# Altium schematic sheet rest.SchDoc
size A4; SheetNumber: 5; SheetTotal: 5
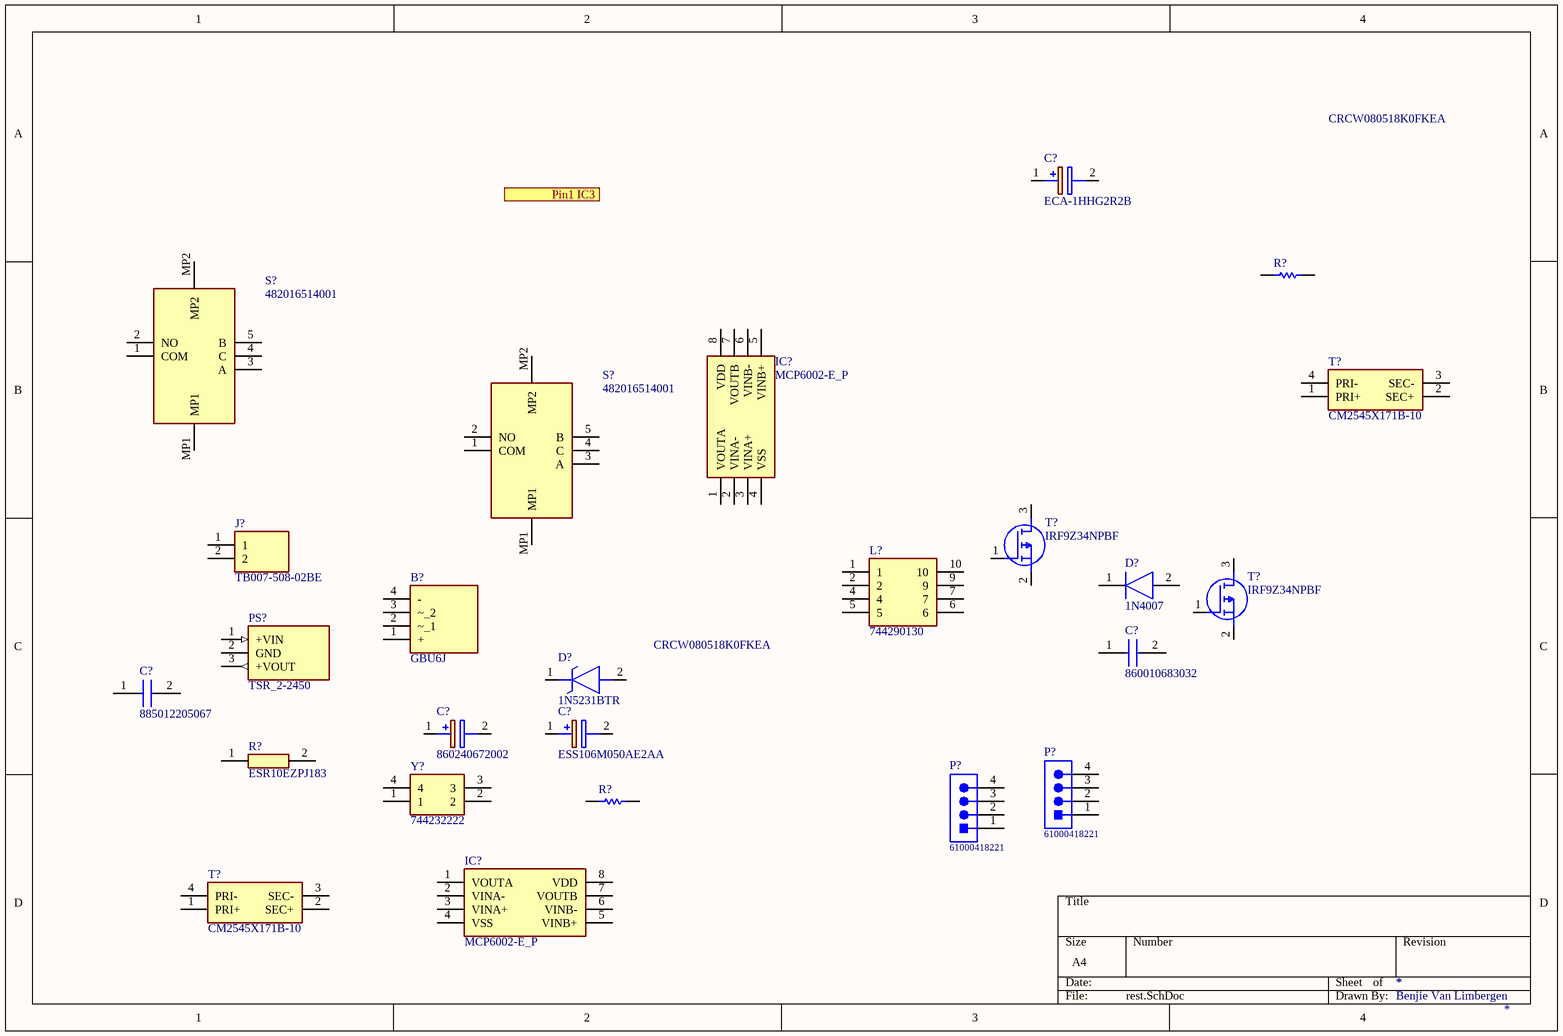
[diagram p0: rest.SchDoc]

## Parts
(Parts that share a designator on the sheet are numbered #1, #2 ... from top to bottom, then left to right.)
B?  GBU6J  [GBU6J]
C?#1  ECA-1HHG2R2B  [CAPPRD200W55D500H1200]
C?#2  860010683032  [CAPPRD1000W80D2200H4100]
C?#3  885012205067  [CAPC1005X55N]
C?#4  860240672002  [CAPPRD200W52D500H1250]
C?#5  ESS106M050AE2AA  [CAPPRD250W45D630H850]
D?#1  1N4007  [DIOAD1410W86L470D235]
D?#2  1N5231BTR  [DIOAD1068W53L380D172]
IC?#1  MCP6002-E_P  [DIP781W56P254L950H533Q8N]
IC?#2  MCP6002-E_P  [DIP781W56P254L950H533Q8N]
J?  TB007-508-02BE  [TB00750802BE]
L?  744290130  [744290130]
P?#1  61000418221  [61000418221]
P?#2  61000418221  [61000418221]
PS?  TSR_2-2450  [TSR-2]
R?#1  CRCW080518K0FKEA  [RESC2013X50X30NL20T20]
R?#2  ESR10EZPJ183  [RESC2012X65N]
R?#3  CRCW080518K0FKEA  [RESC2013X50X30NL20T20]
S?#1  482016514001  [482016514001]
S?#2  482016514001  [482016514001]
T?#1  CM2545X171B-10  [CM2545X171B10]
T?#2  IRF9Z34NPBF  [TO254P469X1042X1967-3P]
T?#3  IRF9Z34NPBF  [TO254P469X1042X1967-3P]
T?#4  CM2545X171B-10  [CM2545X171B10]
Y?  744232222  [744232222]

## Ports
Pin1 IC3

## Nets

Not connected (* = marked no-connect by the designer): B? 1(+) 2(~_1) 3(~_2) 4(-); C?#1 1(+) 2(-); C?#2 1(+) 2(-); C?#3 1 2; C?#4 1(+) 2(-); C?#5 1(+) 2(-); D?#1 1(K) 2(A); D?#2 1(K) 2(A); IC?#1 1(VOUTA) 2(VINA-) 3(VINA+) 4(VSS) 5(VINB+) 6(VINB-) 7(VOUTB) 8(VDD); IC?#2 1(VOUTA) 2(VINA-) 3(VINA+) 4(VSS) 5(VINB+) 6(VINB-) 7(VOUTB) 8(VDD); J? 1 2; L? 1 2 4 5 6 7 9 10; P?#1 1 2 3 4; P?#2 1 2 3 4; PS? 1(+VIN) 2(GND) 3(+VOUT); R?#1 1 2; R?#2 1 2; R?#3 1 2; S?#1 1(COM) 2(NO) 3(A) 4(C) 5(B) MP1 MP2; S?#2 1(COM) 2(NO) 3(A) 4(C) 5(B) MP1 MP2; T?#1 1(PRI+) 2(SEC+) 3(SEC-) 4(PRI-); T?#2 1(G) 2(S) 3(D); T?#3 1(G) 2(S) 3(D); T?#4 1(PRI+) 2(SEC+) 3(SEC-) 4(PRI-); Y? 1 2 3 4

## Notes on the sheet
- Benjie Van Limbergen

## Library data of the parts
B? = GBU6J: Bridge Rectifier; Manufacturer_Name: GeneSiC Semiconductor; Datasheet Link: https://www.diodemodule.com/silicon_products/bridge_rectifiers/gbu6j.pdf; Height: 18.8mm; Manufacturer_Part_Number: GBU6J
C?#1 = ECA-1HHG2R2B: Capacitor Polarised C4; Manufacturer_Name: Panasonic; Datasheet Link: http://industrial.panasonic.com/cdbs/www-data/pdf/RDF0000/ABA0000C1215.pdf; Height: 12mm; Manufacturer_Part_Number: ECA-1HHG2R2B
C?#2 = 860010683032: Capacitor C1; Manufacturer_Name: Wurth Elektronik; Datasheet Link: https://componentsearchengine.com/Datasheets/2/860010683032.pdf; Height: 41mm; Manufacturer_Part_Number: 860010683032
C?#3 = 885012205067: Capacitor C6, C7, C12,C13; Manufacturer_Name: Wurth Elektronik; Datasheet Link: https://katalog.we-online.com/pbs/datasheet/885012205067.pdf; Height: 0.55mm; Manufacturer_Part_Number: 885012205067
C?#4 = 860240672002: Capacitor Polarised; Manufacturer_Name: Wurth Elektronik; Datasheet Link: https://katalog.we-online.de/pbs/datasheet/860240672002.pdf; Height: 12.5mm; Manufacturer_Part_Number: 860240672002
C?#5 = ESS106M050AE2AA: Capacitor Polarised; Manufacturer_Name: Kemet; Datasheet Link: https://content.kemet.com/datasheets/KEM_A4057_ESS.pdf; Height: 8.5mm; Manufacturer_Part_Number: ESS106M050AE2AA
D?#1 = 1N4007: Diode D1; Manufacturer_Name: MULTICOMP; Datasheet Link: http://www.farnell.com/datasheets/1505911.pdf?_ga=2.248087493.396773729.1562531485-167411096.1502103357; Manufacturer_Part_Number: 1N4007
D?#2 = 1N5231BTR: Zener Diode D2; Manufacturer_Name: ON Semiconductor; Datasheet Link: https://componentsearchengine.com/Datasheets/1/1N5231BTR.pdf; Manufacturer_Part_Number: 1N5231BTR
IC?#1 IC?#2 = MCP6002-E_P: IC Dual Opamp; Manufacturer_Name: Microchip; Manufacturer_Part_Number: MCP6002-E/P; Datasheet Link: https://componentsearchengine.com//MCP6002-E_P.pdf; Height: 5.334mm; Mouser2 Part Number: 579-MCP6002-E/P; Mouser2 Price/Stock: https://www.mouser.com/Search/Refine.aspx?Keyword=579-MCP6002-E%2FP
J? = TB007-508-02BE: Connector; Manufacturer_Name: CUI Inc.; Datasheet Link: https://componentsearchengine.com//TB007-508-02BE.pdf; Height: 14mm; Mouser2 Part Number: 490-TB007-508-02BE; Mouser2 Price/Stock: https://www.mouser.com/Search/Refine.aspx?Keyword=490-TB007-508-02BE; Manufacturer_Part_Number: TB007-508-02BE
L? = 744290130: Inductor; Manufacturer_Name: Wurth Elektronik; Datasheet Link: https://componentsearchengine.com/Datasheets/1/744290130.pdf; Height: 7.8mm; Manufacturer_Part_Number: 744290130
P?#1 P?#2 = 61000418221: WR-PHD Pin Header, SMT, pitch 2.54mm, Single Row, Vertical, 4p; Manufacturer: Wurth Elektronik; Pin Number: 4; Rated Current: 3A; Working Voltage: 250VAC; Withstanding Voltage: 500VAC; Contact Resistance: 20mOhm; ComponentLink1Description: Manufacturer; ComponentLink1URL: http://www.we-online.de; ComponentLink2Description: Datasheet; ComponentLink2URL: https://www.we-online.com/catalog/datasheet/61000418221.pdf; Manufacturer Part Number: 61000418221; Pitch: 2.54mm; Operating Temperature: -40 to +125degC; Mounting Technology: SMT; Packaging: Tube; Gender: Pin Header; Row Number: Single; Orientation: Vertical
PS? = TSR_2-2450: Power Supply; Manufacturer_Name: Traco Power; Manufacturer_Part_Number: TSR 2-2450; Datasheet Link: https://componentsearchengine.com//TSR 2-2450.pdf; Mouser2 Part Number: 495-TSR2-2450; Mouser2 Price/Stock: https://www.mouser.com/Search/Refine.aspx?Keyword=495-TSR2-2450
R?#1 R?#3 = CMP-2001-03588-1: Manufacturer: Vishay Dale; Part Number: CRCW080518K0FKEA
R?#2 = ESR10EZPJ183: Resistor SMD 0805; Manufacturer_Name: ROHM Semiconductor; Datasheet Link: https://datasheet.datasheetarchive.com/originals/distributors/Datasheets_SAMA/30ccb516c688c96e56c83a00b77a93f4.pdf; Height: 0.65mm; Manufacturer_Part_Number: ESR10EZPJ183
S?#1 S?#2 = 482016514001: Switch; Manufacturer_Name: Wurth Elektronik; Datasheet Link: https://componentsearchengine.com//482016514001.pdf; Height: 26.9mm; Mouser2 Part Number: 710-482016514001; Mouser2 Price/Stock: https://www.mouser.com/Search/Refine.aspx?Keyword=710-482016514001; Manufacturer_Part_Number: 482016514001
T?#1 T?#4 = CM2545X171B-10: Transformer; Manufacturer_Name: Laird Technologies; Datasheet Link: https://datasheet.datasheetarchive.com/originals/dk/DKDS-7/122753.pdf; Height: 9.5mm; Manufacturer_Part_Number: CM2545X171B-10
T?#2 T?#3 = IRF9Z34NPBF: MOSFET (P-Channel); Manufacturer_Name: Infineon; Datasheet Link: https://componentsearchengine.com//IRF9Z34NPBF.pdf; Height: 4.69mm; Mouser2 Part Number: 942-IRF9Z34NPBF; Mouser2 Price/Stock: https://www.mouser.com/Search/Refine.aspx?Keyword=942-IRF9Z34NPBF; Manufacturer_Part_Number: IRF9Z34NPBF
Y? = 744232222: Crystal or Oscillator; Manufacturer_Name: Wurth Elektronik; Datasheet Link: https://componentsearchengine.com//744232222.pdf; Height: 2mm; Mouser2 Part Number: 710-744232222; Mouser2 Price/Stock: https://www.mouser.com/Search/Refine.aspx?Keyword=710-744232222; Manufacturer_Part_Number: 744232222